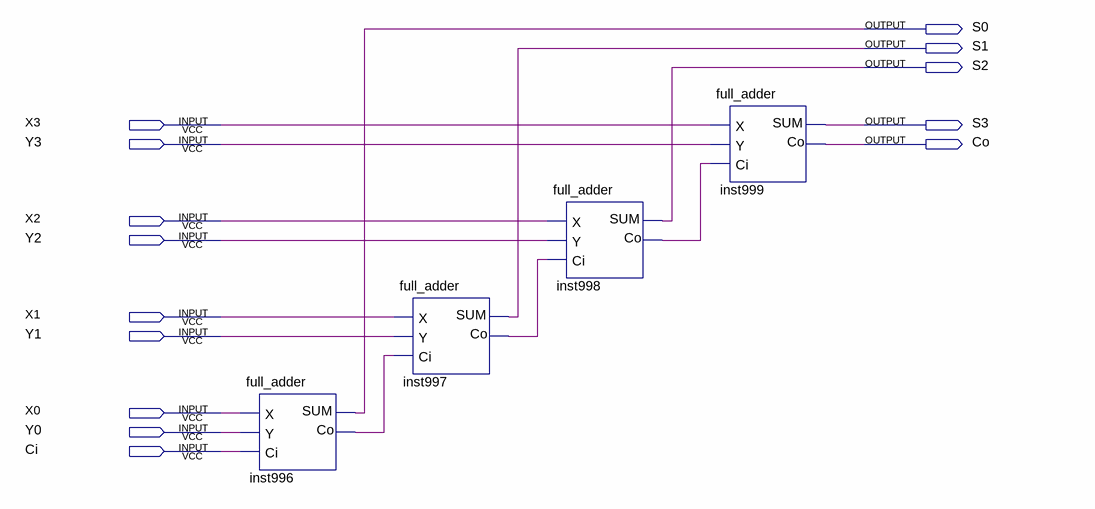
[diagram p0: schematic sheet]
// Quartus schematic 4bitadder.bdf as structural Verilog: 4 symbols, 14 pins
module \4bitadder  (
  input  X3,
  input  Y3,
  input  X2,
  input  Y2,
  input  X1,
  input  Y1,
  input  X0,
  input  Y0,
  input  Ci,
  output S0,
  output S1,
  output S2,
  output S3,
  output Co
);

  wire inst996_co, inst997_co, inst998_co;

  full_adder inst996 (.X(X0), .Y(Y0), .Ci(Ci), .SUM(S0), .Co(inst996_co));
  full_adder inst997 (.X(X1), .Y(Y1), .Ci(inst996_co), .SUM(S1), .Co(inst997_co));
  full_adder inst998 (.X(X2), .Y(Y2), .Ci(inst997_co), .SUM(S2), .Co(inst998_co));
  full_adder inst999 (.X(X3), .Y(Y3), .Ci(inst998_co), .SUM(S3), .Co(Co));
endmodule
